# Altium schematic sheet MicsBus.SchDoc: Main
size A4; Organization: Autobot Limited; Address1: 96, boulevard Bessiere; Address4: 75017 PARIS; SheetNumber: 1
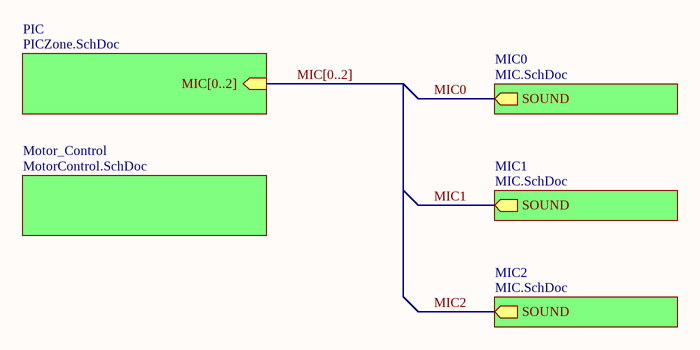
[diagram p0: MicsBus.SchDoc]

## Sub-sheets
MIC0 = MIC.SchDoc: SOUND (out)
MIC1 = MIC.SchDoc: SOUND (out)
MIC2 = MIC.SchDoc: SOUND (out)
Motor_Control = MotorControl.SchDoc: no entries
PIC = PICZone.SchDoc: MIC[0..2] (in)

## Nets
MIC0: sheet MIC0/SOUND
MIC1: sheet MIC1/SOUND
MIC2: sheet MIC2/SOUND

## Buses and harness runs
bus MIC[0..2] = sheet PIC/MIC[0..2]

## Notes on the sheet
- Title
- Size:
- Date:
- A4
- Number:
- Time:
- Revision:
- Sheet
- of
- File: